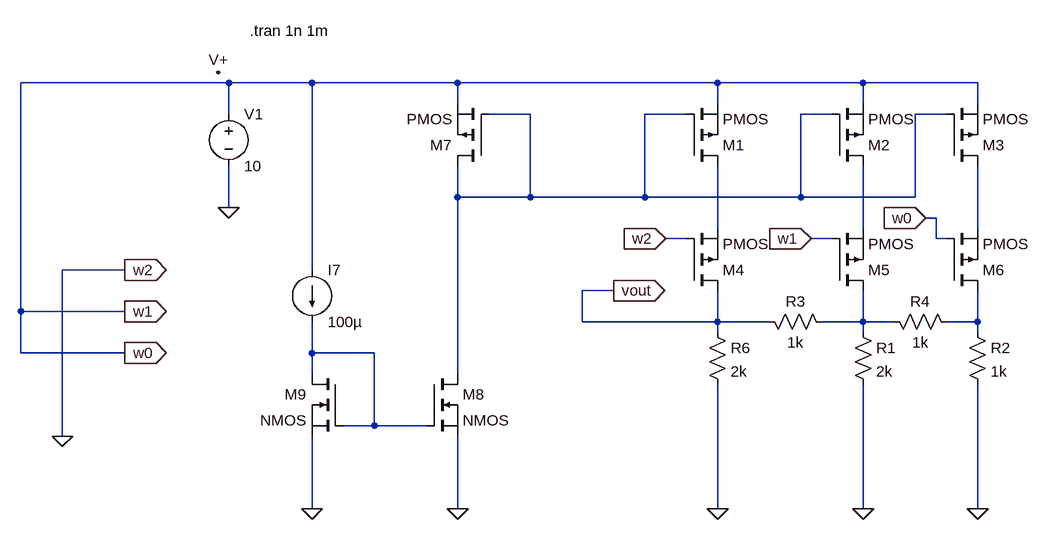
[diagram p0: schematic simple_mirror.asc]
simple_mirror.asc, the LTspice schematic file:
Version 4
SHEET 1 1200 704
WIRE -800 -368 -1120 -368
WIRE -672 -368 -800 -368
WIRE -448 -368 -672 -368
WIRE -48 -368 -448 -368
WIRE 176 -368 -48 -368
WIRE 352 -368 176 -368
WIRE -448 -336 -448 -368
WIRE -48 -336 -48 -368
WIRE 176 -336 176 -368
WIRE 352 -336 352 -368
WIRE -800 -320 -800 -368
WIRE -336 -320 -400 -320
WIRE -96 -320 -160 -320
WIRE 128 -320 80 -320
WIRE 304 -320 256 -320
WIRE -448 -192 -448 -240
WIRE -336 -192 -336 -320
WIRE -336 -192 -448 -192
WIRE -160 -192 -160 -320
WIRE -160 -192 -336 -192
WIRE 80 -192 80 -320
WIRE 80 -192 -160 -192
WIRE 256 -192 256 -320
WIRE 256 -192 80 -192
WIRE -800 -176 -800 -240
WIRE 288 -160 272 -160
WIRE -48 -144 -48 -240
WIRE 176 -144 176 -240
WIRE 352 -144 352 -240
WIRE -96 -128 -128 -128
WIRE 128 -128 96 -128
WIRE 288 -128 288 -160
WIRE 304 -128 288 -128
WIRE -960 -80 -1056 -80
WIRE -672 -80 -672 -368
WIRE -208 -48 -256 -48
WIRE -1120 -16 -1120 -368
WIRE -960 -16 -1120 -16
WIRE -256 0 -256 -48
WIRE -48 0 -48 -48
WIRE -48 0 -256 0
WIRE 32 0 -48 0
WIRE 176 0 176 -48
WIRE 176 0 112 0
WIRE 224 0 176 0
WIRE 352 0 352 -48
WIRE 352 0 304 0
WIRE -48 16 -48 0
WIRE 176 16 176 0
WIRE 352 16 352 0
WIRE -1120 48 -1120 -16
WIRE -960 48 -1120 48
WIRE -672 48 -672 0
WIRE -576 48 -672 48
WIRE -672 80 -672 48
WIRE -448 80 -448 -192
WIRE -576 160 -576 48
WIRE -576 160 -624 160
WIRE -496 160 -576 160
WIRE -1056 176 -1056 -80
WIRE -672 288 -672 176
WIRE -448 288 -448 176
WIRE -48 288 -48 96
WIRE 176 288 176 96
WIRE 352 288 352 96
FLAG -448 288 0
FLAG -800 -176 0
FLAG -48 288 0
FLAG 176 288 0
FLAG 352 288 0
FLAG -816 -384 V+
FLAG -128 -128 w2
IOPIN -128 -128 In
FLAG 96 -128 w1
IOPIN 96 -128 In
FLAG 272 -160 w0
IOPIN 272 -160 In
FLAG -960 -80 w2
IOPIN -960 -80 Out
FLAG -960 -16 w1
IOPIN -960 -16 Out
FLAG -960 48 w0
IOPIN -960 48 Out
FLAG -1056 176 0
FLAG -208 -48 vout
IOPIN -208 -48 Out
FLAG -672 288 0
SYMBOL pmos -96 -240 M180
SYMATTR InstName M1
SYMBOL voltage -800 -336 R0
SYMATTR InstName V1
SYMATTR Value 10
SYMBOL pmos -400 -240 R180
SYMATTR InstName M7
SYMBOL current -672 -80 R0
SYMATTR InstName I7
SYMATTR Value 100µ
SYMBOL res -64 0 R0
SYMATTR InstName R6
SYMATTR Value 2k
SYMBOL pmos 128 -240 M180
SYMATTR InstName M2
SYMBOL res 160 0 R0
SYMATTR InstName R1
SYMATTR Value 2k
SYMBOL pmos 304 -240 M180
SYMATTR InstName M3
SYMBOL res 336 0 R0
SYMATTR InstName R2
SYMATTR Value 1k
SYMBOL pmos -96 -48 M180
SYMATTR InstName M4
SYMBOL pmos 128 -48 M180
SYMATTR InstName M5
SYMBOL pmos 304 -48 M180
SYMATTR InstName M6
SYMBOL res 128 16 M270
WINDOW 0 32 56 VTop 2
WINDOW 3 0 56 VBottom 2
SYMATTR InstName R3
SYMATTR Value 1k
SYMBOL res 320 16 M270
WINDOW 0 32 56 VTop 2
WINDOW 3 0 56 VBottom 2
SYMATTR InstName R4
SYMATTR Value 1k
SYMBOL nmos -496 80 R0
SYMATTR InstName M8
SYMBOL nmos -624 80 M0
SYMATTR InstName M9
TEXT -768 -448 Left 2 !.tran 1n 1m

The netlist it stands for:
* simple_mirror.asc
M1 N002 N001 w0 w0 PMOS
V1 w0 0 10
M7 N001 N001 w0 w0 PMOS
I7 w0 N007 100µ
R6 vout 0 2k
M2 N003 N001 w0 w0 PMOS
R1 N005 0 2k
M3 N004 N001 w0 w0 PMOS
R2 N006 0 1k
M4 vout 0 N002 N002 PMOS
M5 N005 w0 N003 N003 PMOS
M6 N006 w0 N004 N004 PMOS
R3 N005 vout 1k
R4 N006 N005 1k
M8 N001 N007 0 0 NMOS
M9 N007 N007 0 0 NMOS
.model NMOS NMOS
.model PMOS PMOS
.lib standard.mos
.tran 1n 1m
.backanno
.end